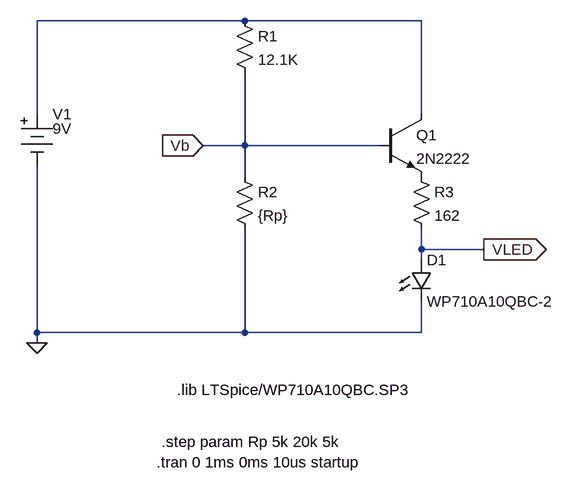
[diagram p0: schematic Photosensor.asc]
Photosensor.asc, the LTspice schematic file:
Version 4
SHEET 1 936 680
WIRE 176 -48 -144 -48
WIRE 448 -48 176 -48
WIRE -144 96 -144 -48
WIRE 448 96 448 -48
WIRE 176 144 176 32
WIRE 176 144 112 144
WIRE 384 144 176 144
WIRE 176 192 176 144
WIRE 448 304 448 272
WIRE 544 304 448 304
WIRE 448 320 448 304
WIRE -144 432 -144 176
WIRE 176 432 176 272
WIRE 176 432 -144 432
WIRE 448 432 448 384
WIRE 448 432 176 432
WIRE -144 448 -144 432
FLAG -144 448 0
FLAG 112 144 Vb
IOPIN 112 144 In
FLAG 544 304 VLED
IOPIN 544 304 Out
SYMBOL battery -144 80 R0
WINDOW 123 0 0 Left 2
WINDOW 3 24 38 Left 2
SYMATTR InstName V1
SYMATTR Value 9V
SYMATTR SpiceLine Rser=0
SYMBOL res 160 -64 R0
SYMATTR InstName R1
SYMATTR Value 12.1K
SYMBOL res 160 176 R0
SYMATTR InstName R2
SYMATTR Value {Rp}
SYMBOL npn 384 96 R0
SYMATTR InstName Q1
SYMATTR Value 2N2222
SYMBOL res 432 176 R0
SYMATTR InstName R3
SYMATTR Value 162
SYMBOL LED 432 320 R0
SYMATTR InstName D1
SYMATTR Value WP710A10QBC-2
TEXT 72 520 Left 2 !.lib LTSpice/WP710A10QBC.SP3
TEXT 40 632 Left 2 !.tran 0 1ms 0ms 10us startup
TEXT 48 600 Left 2 !.step param Rp 5k 20k 5k

The netlist it stands for:
* Photosensor.asc
V1 N001 0 9V Rser=0
R1 N001 Vb 12.1K
R2 Vb 0 {Rp}
Q1 N001 Vb P001 0 2N2222
R3 P001 VLED 162
D1 VLED 0 WP710A10QBC-2
.model D D
.lib standard.dio
.model NPN NPN
.model PNP PNP
.lib standard.bjt
.lib LTSpice/WP710A10QBC.SP3
.tran 0 1ms 0ms 10us startup
.step param Rp 5k 20k 5k
.backanno
.end

* Results of the author's LTspice run, read from the files saved beside the schematic
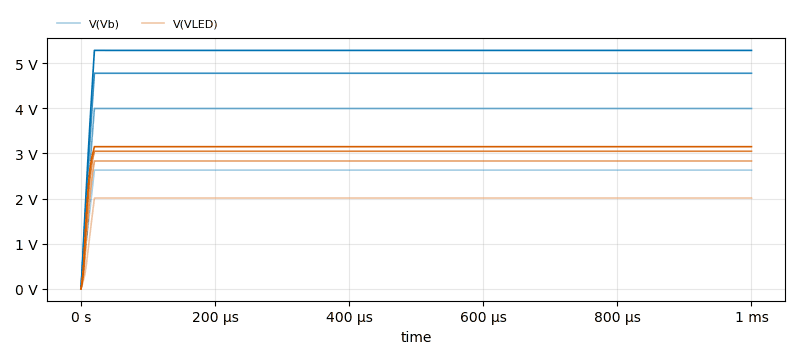
[diagram p1: Transient Analysis of Photosensor.asc, plotted from the saved traces]
* Transient Analysis, 7 runs:
*   V(Vb) [run 1]: min 0 V, max 2.632 V, average 2.603 V, rms 2.612 V, last 2.63 V
*   V(Vb) [run 2]: 0 V at time=0 s, 0 V at time=0 s, min 0 V, max 0 V
*   V(Vb) [run 3]: min 0 V, max 3.998 V, average 3.955 V, rms 3.968 V, last 3.995 V
*   V(Vb) [run 4]: 0 V at time=0 s, 0 V at time=0 s, min 0 V, max 0 V
*   V(Vb) [run 5]: min 0 V, max 4.778 V, average 4.729 V, rms 4.744 V, last 4.775 V
*   V(Vb) [run 6]: 0 V at time=0 s, 0 V at time=0 s, min 0 V, max 0 V
*   V(Vb) [run 7]: min 0 V, max 5.283 V, average 5.231 V, rms 5.247 V, last 5.282 V
*   V(VLED) [run 1]: min 0 V, max 2.011 V, average 1.988 V, rms 1.997 V, last 2.011 V
*   V(VLED) [run 2]: 0 V at time=0 s, 0 V at time=0 s, min 0 V, max 0 V
*   V(VLED) [run 3]: min 0 V, max 2.832 V, average 2.803 V, rms 2.813 V, last 2.832 V
*   V(VLED) [run 4]: 0 V at time=0 s, 0 V at time=0 s, min 0 V, max 0 V
*   V(VLED) [run 5]: min 0 V, max 3.049 V, average 3.02 V, rms 3.03 V, last 3.047 V
*   V(VLED) [run 6]: 0 V at time=0 s, 0 V at time=0 s, min 0 V, max 0 V
*   V(VLED) [run 7]: min 0 V, max 3.149 V, average 3.122 V, rms 3.131 V, last 3.149 V